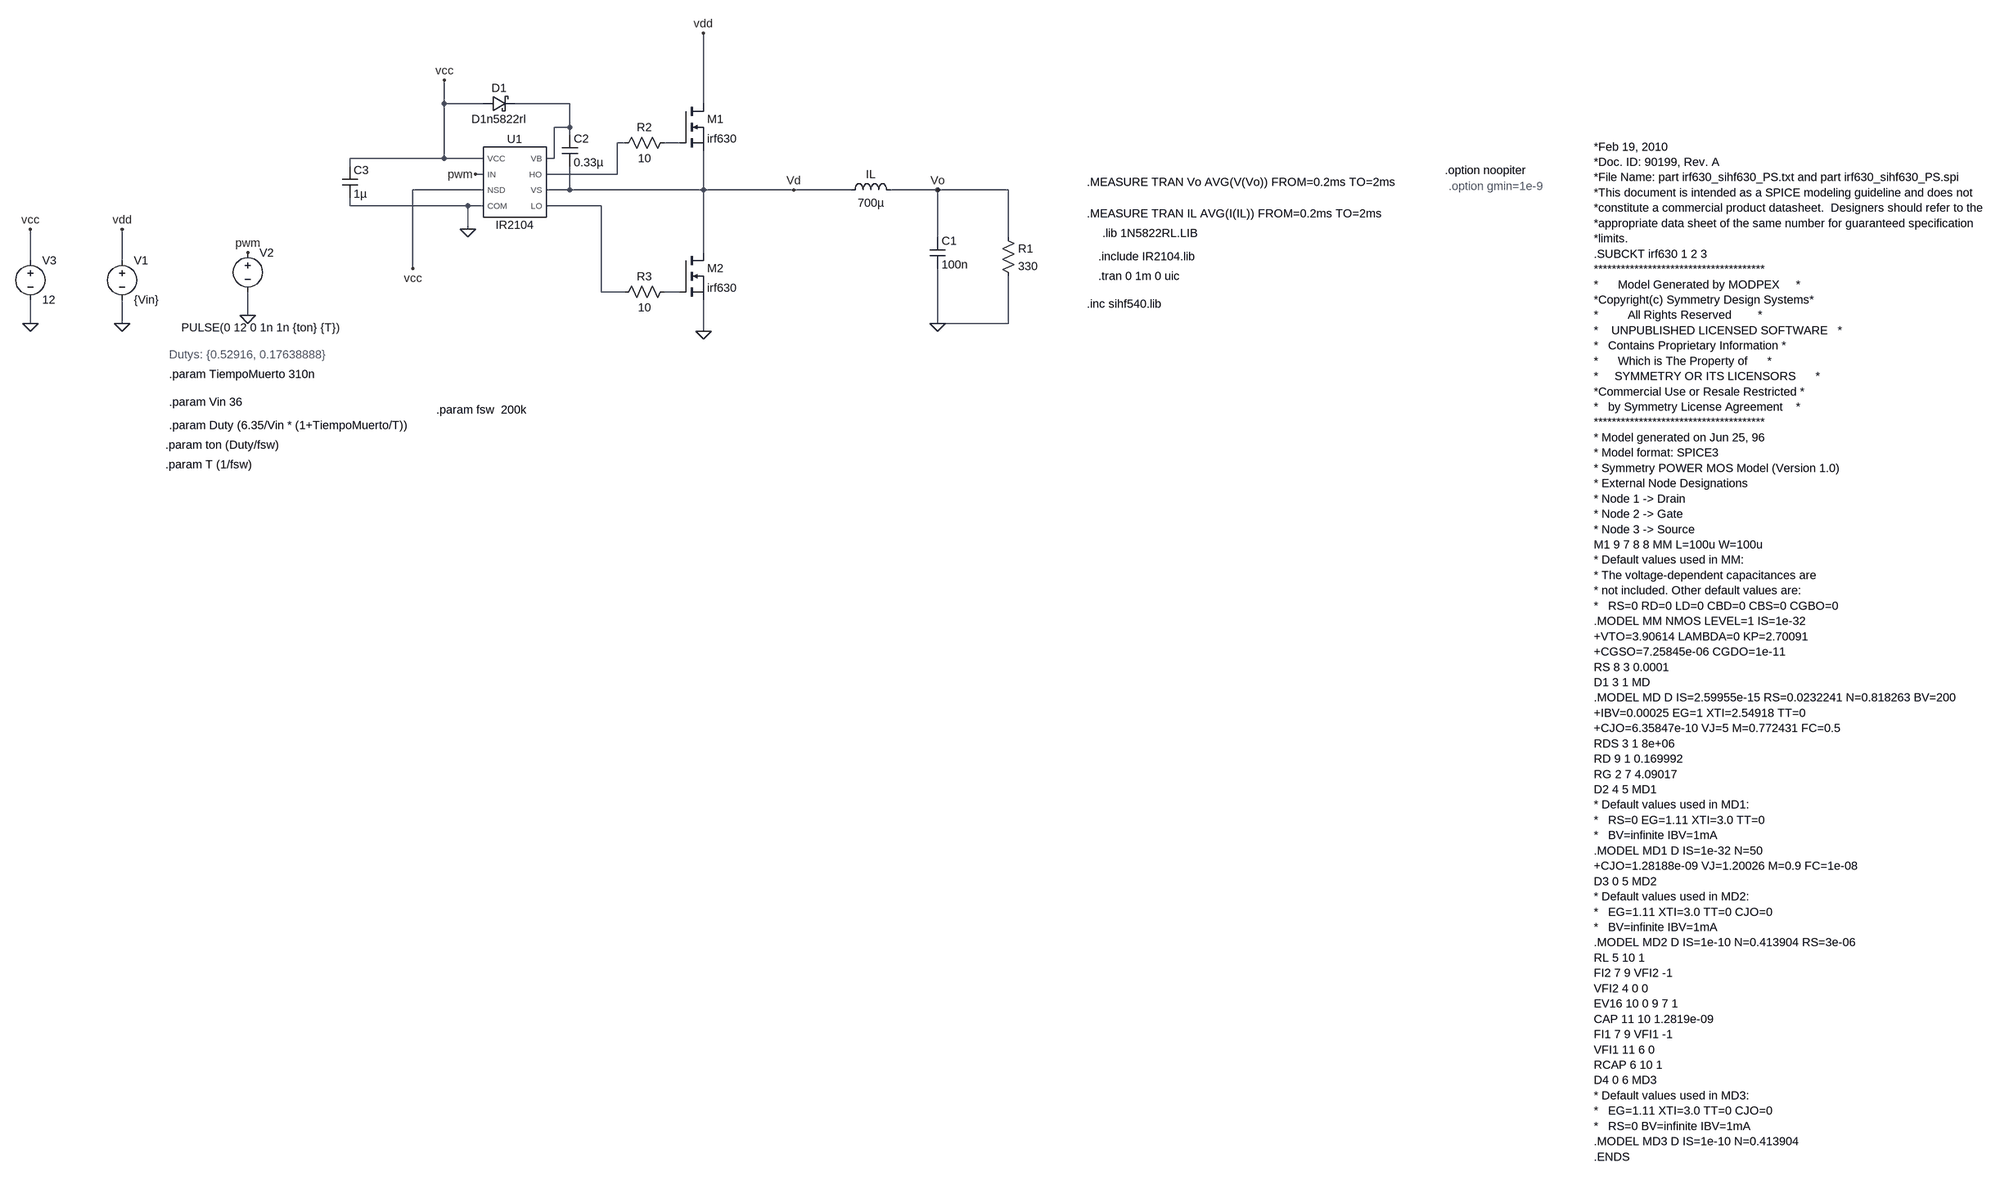
[diagram p0: schematic Buck-lazo-abierto.asc]
Buck-lazo-abierto.asc, the LTspice schematic file:
Version 4
SHEET 1 3480 1872
WIRE -272 -80 -272 -128
WIRE -192 -80 -272 -80
WIRE -16 -80 -128 -80
WIRE 256 -80 256 -224
WIRE -16 -32 -16 -80
WIRE -16 -32 -48 -32
WIRE -16 -16 -16 -32
WIRE 96 0 80 0
WIRE 208 0 176 0
WIRE -272 32 -272 -80
WIRE -272 32 -464 32
WIRE -192 32 -272 32
WIRE -48 32 -48 -32
WIRE -48 32 -64 32
WIRE -464 48 -464 32
WIRE -192 64 -208 64
WIRE 80 64 80 0
WIRE 80 64 -64 64
WIRE -192 96 -336 96
WIRE -16 96 -16 48
WIRE -16 96 -64 96
WIRE 256 96 256 16
WIRE 256 96 -16 96
WIRE 528 96 256 96
WIRE 672 96 528 96
WIRE 848 96 752 96
WIRE 992 96 848 96
WIRE -464 128 -464 112
WIRE -224 128 -464 128
WIRE -192 128 -224 128
WIRE 48 128 -64 128
WIRE -224 176 -224 128
WIRE 848 192 848 96
WIRE 992 192 992 96
WIRE 256 224 256 96
WIRE -1168 240 -1168 176
WIRE -928 240 -928 176
WIRE -336 256 -336 96
WIRE 48 304 48 128
WIRE 96 304 48 304
WIRE 208 304 176 304
WIRE -672 352 -672 304
WIRE -1168 368 -1168 320
WIRE -928 368 -928 320
WIRE 848 368 848 256
WIRE 992 368 992 272
WIRE 992 368 848 368
WIRE 256 384 256 320
FLAG 848 368 0
FLAG 848 96 Vo
FLAG 528 96 Vd
FLAG -672 352 0
FLAG -672 224 pwm
FLAG -928 368 0
FLAG -928 176 vdd
FLAG 256 384 0
FLAG 256 -224 vdd
FLAG -208 64 pwm
FLAG -224 176 0
FLAG -272 -128 vcc
FLAG -336 256 vcc
FLAG -1168 368 0
FLAG -1168 176 vcc
SYMBOL voltage -672 208 R0
WINDOW 3 -135 169 Left 2
WINDOW 123 0 0 Left 0
WINDOW 39 0 0 Left 0
SYMATTR Value PULSE(0 12 0 1n 1n {ton} {T})
SYMATTR InstName V2
SYMBOL ind 656 112 R270
WINDOW 0 32 56 VTop 2
WINDOW 3 5 56 VBottom 2
SYMATTR InstName IL
SYMATTR Value 700µ
SYMBOL cap 832 192 R0
SYMATTR InstName C1
SYMATTR Value 100n
SYMBOL res 976 176 R0
SYMATTR InstName R1
SYMATTR Value 330
SYMBOL IR2104 -128 80 R0
SYMATTR InstName U1
SYMBOL voltage -928 224 R0
WINDOW 123 0 0 Left 0
WINDOW 39 0 0 Left 0
SYMATTR InstName V1
SYMATTR Value {Vin}
SYMBOL res 192 -16 R90
WINDOW 0 0 56 VBottom 2
WINDOW 3 32 56 VTop 2
SYMATTR InstName R2
SYMATTR Value 10
SYMBOL cap -32 -16 R0
SYMATTR InstName C2
SYMATTR Value 0.33µ
SYMBOL schottky -192 -64 R270
WINDOW 0 32 32 VTop 2
WINDOW 3 0 32 VBottom 2
SYMATTR InstName D1
SYMATTR Value D1n5822rl
SYMATTR Description Diode
SYMATTR Type diode
SYMBOL cap -480 48 R0
SYMATTR InstName C3
SYMATTR Value 1µ
SYMBOL nmos 208 -80 R0
SYMATTR InstName M1
SYMATTR Value irf630
SYMBOL res 192 288 R90
WINDOW 0 0 56 VBottom 2
WINDOW 3 32 56 VTop 2
SYMATTR InstName R3
SYMATTR Value 10
SYMBOL voltage -1168 224 R0
WINDOW 123 0 0 Left 0
WINDOW 39 0 0 Left 0
SYMATTR InstName V3
SYMATTR Value 12
SYMBOL nmos 208 224 R0
SYMATTR InstName M2
SYMATTR Value irf630
TEXT 1264 272 Left 2 !.tran 0 1m 0 uic
TEXT 1240 80 Left 2 !.MEASURE TRAN Vo AVG(V(Vo)) FROM=0.2ms TO=2ms
TEXT 1240 144 Left 2 !.MEASURE TRAN IL AVG(I(IL)) FROM=0.2ms TO=2ms
TEXT 1264 232 Left 2 !.include IR2104.lib
TEXT 1272 184 Left 2 !.lib 1N5822RL.LIB
TEXT 2016 56 Left 2 !.option noopiter
TEXT 2024 88 Left 2 ;.option gmin=1e-9
TEXT -832 472 Left 2 !.param TiempoMuerto 310n
TEXT -832 432 Left 2 ;Dutys: {0.52916, 0.17638888}
TEXT -832 576 Left 2 !.param Duty (6.35/Vin * (1+TiempoMuerto/T))
TEXT -288 544 Left 2 !.param fsw  200k
TEXT -840 616 Left 2 !.param ton (Duty/fsw)
TEXT -832 528 Left 2 !.param Vin 36
TEXT -840 656 Left 2 !.param T (1/fsw)
TEXT 1240 328 Left 2 !.inc sihf540.lib
TEXT 2608 8 Left 2 !*Feb 19, 2010\n*Doc. ID: 90199, Rev. A\n*File Name: part irf630_sihf630_PS.txt and part irf630_sihf630_PS.spi\n*This document is intended as a SPICE modeling guideline and does not\n*constitute a commercial product datasheet.  Designers should refer to the\n*appropriate data sheet of the same number for guaranteed specification\n*limits.\n.SUBCKT irf630 1 2 3\n**************************************\n*      Model Generated by MODPEX     *\n*Copyright(c) Symmetry Design Systems*\n*         All Rights Reserved        *\n*    UNPUBLISHED LICENSED SOFTWARE   *\n*   Contains Proprietary Information *\n*      Which is The Property of      *\n*     SYMMETRY OR ITS LICENSORS      *\n*Commercial Use or Resale Restricted *\n*   by Symmetry License Agreement    *\n**************************************\n* Model generated on Jun 25, 96\n* Model format: SPICE3\n* Symmetry POWER MOS Model (Version 1.0)\n* External Node Designations\n* Node 1 -> Drain\n* Node 2 -> Gate\n* Node 3 -> Source\nM1 9 7 8 8 MM L=100u W=100u\n* Default values used in MM:\n* The voltage-dependent capacitances are\n* not included. Other default values are:\n*   RS=0 RD=0 LD=0 CBD=0 CBS=0 CGBO=0\n.MODEL MM NMOS LEVEL=1 IS=1e-32\n+VTO=3.90614 LAMBDA=0 KP=2.70091\n+CGSO=7.25845e-06 CGDO=1e-11\nRS 8 3 0.0001\nD1 3 1 MD\n.MODEL MD D IS=2.59955e-15 RS=0.0232241 N=0.818263 BV=200\n+IBV=0.00025 EG=1 XTI=2.54918 TT=0\n+CJO=6.35847e-10 VJ=5 M=0.772431 FC=0.5\nRDS 3 1 8e+06\nRD 9 1 0.169992\nRG 2 7 4.09017\nD2 4 5 MD1\n* Default values used in MD1:\n*   RS=0 EG=1.11 XTI=3.0 TT=0\n*   BV=infinite IBV=1mA\n.MODEL MD1 D IS=1e-32 N=50\n+CJO=1.28188e-09 VJ=1.20026 M=0.9 FC=1e-08\nD3 0 5 MD2\n* Default values used in MD2:\n*   EG=1.11 XTI=3.0 TT=0 CJO=0\n*   BV=infinite IBV=1mA\n.MODEL MD2 D IS=1e-10 N=0.413904 RS=3e-06\nRL 5 10 1\nFI2 7 9 VFI2 -1\nVFI2 4 0 0\nEV16 10 0 9 7 1\nCAP 11 10 1.2819e-09\nFI1 7 9 VFI1 -1\nVFI1 11 6 0\nRCAP 6 10 1\nD4 0 6 MD3\n* Default values used in MD3:\n*   EG=1.11 XTI=3.0 TT=0 CJO=0\n*   RS=0 BV=infinite IBV=1mA\n.MODEL MD3 D IS=1e-10 N=0.413904\n.ENDS

The netlist it stands for:
* Buck-lazo-abierto.asc
V2 pwm 0 PULSE(0 12 0 1n 1n {ton} {T})
L§IL Vd Vo 700µ
C1 Vo 0 100n
R1 Vo 0 330
XU1 N004 N002 0 pwm vcc N001 Vd vcc IR2104  ; pins LO HO COM IN VCC VB VS NSD
V1 vdd 0 {Vin}
R2 N003 N002 10
C2 N001 Vd 0.33µ
D1 vcc N001 D1n5822rl
C3 vcc 0 1µ
M1 vdd N003 Vd Vd irf630
R3 N005 N004 10
V3 vcc 0 12
M2 Vd N005 0 0 irf630
.model D D
.lib standard.dio
.model NMOS NMOS
.model PMOS PMOS
.lib standard.mos
.tran 0 1m 0 uic
.MEASURE TRAN Vo AVG(V(Vo)) FROM=0.2ms TO=2ms
.MEASURE TRAN IL AVG(I(IL)) FROM=0.2ms TO=2ms
.include IR2104.lib
.lib 1N5822RL.LIB
.option noopiter
* .option gmin=1e-9
.param TiempoMuerto 310n
* Dutys: {0.52916, 0.17638888}
.param Duty (6.35/Vin * (1+TiempoMuerto/T))
.param fsw  200k
.param ton (Duty/fsw)
.param Vin 36
.param T (1/fsw)
.inc sihf540.lib
*Feb 19, 2010
*Doc. ID: 90199, Rev. A
*File Name: part irf630_sihf630_PS.txt and part irf630_sihf630_PS.spi
*This document is intended as a SPICE modeling guideline and does not
*constitute a commercial product datasheet.  Designers should refer to the
*appropriate data sheet of the same number for guaranteed specification
*limits.
.SUBCKT irf630 1 2 3
**************************************
*      Model Generated by MODPEX     *
*Copyright(c) Symmetry Design Systems*
*         All Rights Reserved        *
*    UNPUBLISHED LICENSED SOFTWARE   *
*   Contains Proprietary Information *
*      Which is The Property of      *
*     SYMMETRY OR ITS LICENSORS      *
*Commercial Use or Resale Restricted *
*   by Symmetry License Agreement    *
**************************************
* Model generated on Jun 25, 96
* Model format: SPICE3
* Symmetry POWER MOS Model (Version 1.0)
* External Node Designations
* Node 1 -> Drain
* Node 2 -> Gate
* Node 3 -> Source
M1 9 7 8 8 MM L=100u W=100u
* Default values used in MM:
* The voltage-dependent capacitances are
* not included. Other default values are:
*   RS=0 RD=0 LD=0 CBD=0 CBS=0 CGBO=0
.MODEL MM NMOS LEVEL=1 IS=1e-32
+VTO=3.90614 LAMBDA=0 KP=2.70091
+CGSO=7.25845e-06 CGDO=1e-11
RS 8 3 0.0001
D1 3 1 MD
.MODEL MD D IS=2.59955e-15 RS=0.0232241 N=0.818263 BV=200
+IBV=0.00025 EG=1 XTI=2.54918 TT=0
+CJO=6.35847e-10 VJ=5 M=0.772431 FC=0.5
RDS 3 1 8e+06
RD 9 1 0.169992
RG 2 7 4.09017
D2 4 5 MD1
* Default values used in MD1:
*   RS=0 EG=1.11 XTI=3.0 TT=0
*   BV=infinite IBV=1mA
.MODEL MD1 D IS=1e-32 N=50
+CJO=1.28188e-09 VJ=1.20026 M=0.9 FC=1e-08
D3 0 5 MD2
* Default values used in MD2:
*   EG=1.11 XTI=3.0 TT=0 CJO=0
*   BV=infinite IBV=1mA
.MODEL MD2 D IS=1e-10 N=0.413904 RS=3e-06
RL 5 10 1
FI2 7 9 VFI2 -1
VFI2 4 0 0
EV16 10 0 9 7 1
CAP 11 10 1.2819e-09
FI1 7 9 VFI1 -1
VFI1 11 6 0
RCAP 6 10 1
D4 0 6 MD3
* Default values used in MD3:
*   EG=1.11 XTI=3.0 TT=0 CJO=0
*   RS=0 BV=infinite IBV=1mA
.MODEL MD3 D IS=1e-10 N=0.413904
.ENDS
.lib C:\Users\---\Desktop\DCE\dce-g5-proyecto_integrador\Checkpoint 4\Buck\IR2104.lib
.backanno
.end